# EasyEDA Pro project Sauce Dispenser.eprj

# Schematic Schematic1

## Sheets
1 P1: Board Name: Board1; Create Date: 2026-06-05; Page Name: P1; Project Name: Sauce Dispenser; Schematic Name: Schematic1; Update Date: 2026-06-06; Company: EasyEDA.com; Page Size: A4; Version: V1.0
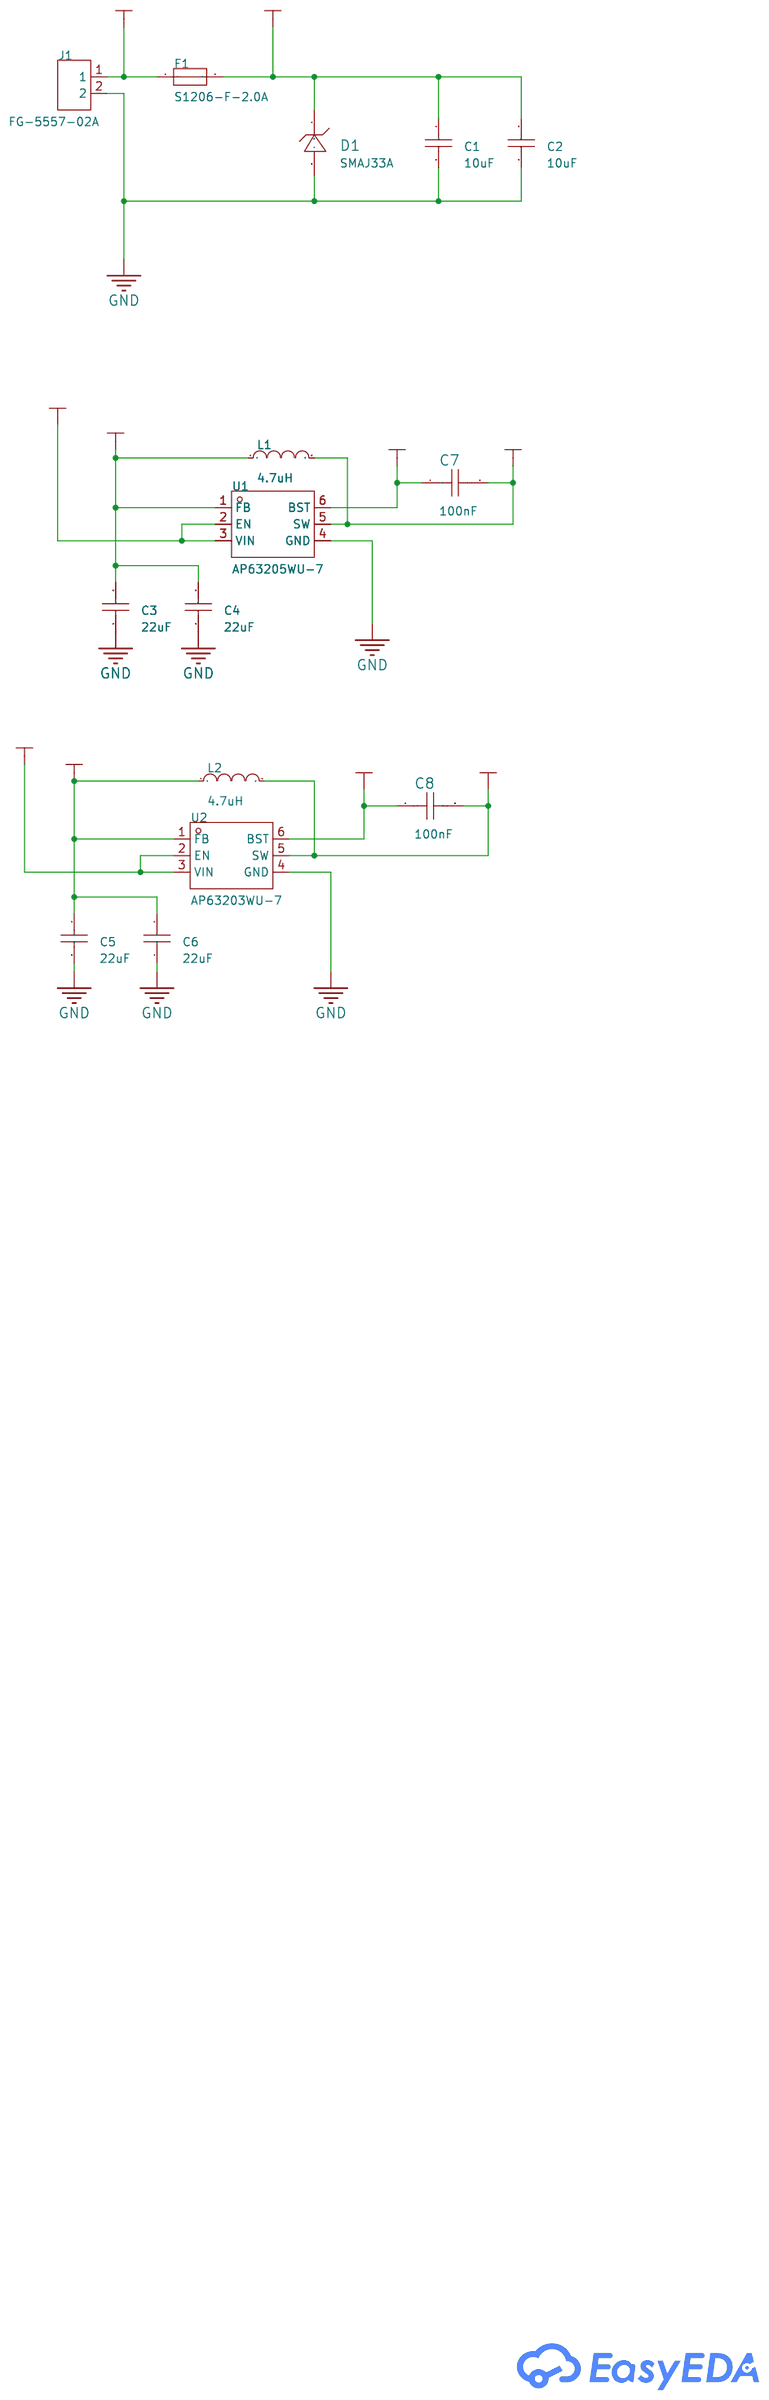
[diagram p0: P1]
2 P2: Create Date: 2026-06-06; Project Name: Project Name; Schematic Name: Schematic Name; Update Date: 2021.11.05
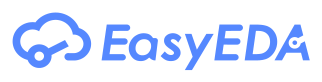
[diagram p1: P2]

## Parts
C1  10uF  [C1206]
C2  10uF  [C1206]
C3  22uF  [C1206]
C4  22uF  [C1206]
C5  22uF  [C1206]
C6  22uF  [C1206]
C7  100nF  [C0603]
C8  100nF  [C0603]
D1  SMAJ33A  [SMA_L4.3-W2.6-LS5.2-RD]
F1  S1206-F-2.0A  [F1206]
J1  FG-5557-02A  [CONN-TH_FG-5557-02A]
L1  4.7uH  [IND-SMD_L5.4-W5.2]
L2  4.7uH  [IND-SMD_L5.4-W5.2]
U1  AP63205WU-7  [TSOT-23-6_L2.9-W1.6-P0.95-LS2.8-BL]
U2  AP63203WU-7  [TSOT-26_L2.9-W1.6-P0.95-LS2.8-BL]

## Library data of the parts
C1 C2 = CL31A106KBHNNNE: LCSC Part Name: 10uF ±10% 50V; Supplier Part: C13585; Manufacturer: SAMSUNG(三星); Supplier Footprint: 1206; JLCPCB Part Class: Basic Part; Datasheet: https://item.szlcsc.com/datasheet/CL31A106KBHNNNE/14236.html; Supplier: LCSC; Tolerance: ±10%; Voltage Rating: 50V; Temperature Coefficient: X5R
C3-C6 = CL31A226KAHNNNE: LCSC Part Name: 22uF ±10% 25V; Supplier Part: C12891; Manufacturer: SAMSUNG(三星); Supplier Footprint: 1206; JLCPCB Part Class: Basic Part; Datasheet: https://item.szlcsc.com/datasheet/CL31A226KAHNNNE/13537.html; Supplier: LCSC; Tolerance: ±10%; Voltage Rating: 25V; Temperature Coefficient: X5R
C7 C8 = CL10B104KB8NNNC: LCSC Part Name: 100nF ±10% 50V; Supplier Part: C1591; Manufacturer: SAMSUNG(三星); Supplier Footprint: 0603; JLCPCB Part Class: Extended Part; Datasheet: https://item.szlcsc.com/datasheet/CL10B104KB8NNNC/1943.html; Supplier: LCSC; Tolerance: ±10%; Voltage Rating: 50V; Temperature Coefficient: X7R
D1 = SMAJ33A_C113966: LCSC Part Name: 单向TVS 33V截止 7.5A峰值脉冲; Supplier Part: C113966; Manufacturer: MDD; Supplier Footprint: SMA(DO-214AC); JLCPCB Part Class: Extended Part; Datasheet: https://atta.szlcsc.com/upload/public/pdf/source/20230314/4319D8044EE29783A53F6AC60595AA71.pdf; Supplier: LCSC; Reverse Stand-Off Voltage (Vrwm): 33V; Maximum Clamping Voltage: 53.3V; Peak Pulse Current (Ipp)@10/1000us: 7.5A; Breakdown Voltage: 36.7V; Type: TVS
F1 = S1206-F-2.0A: LCSC Part Name: 贴片式陶瓷保险丝; Supplier Part: C553922; Manufacturer: SART(萨特); Supplier Footprint: 1206; JLCPCB Part Class: Extended Part; Datasheet: https://item.szlcsc.com/datasheet/S1206-F-2.0A/574959.html; Supplier: LCSC; Type: Surface Mount Fuse; Current Rating: 2A; Voltage Rating (DC): 32V; Operating Temperature: -55℃~+125℃; Melting I2t: 0.1251; Interrupt Rating: 50A; Length: 3.2mm; Width: 1.6mm
J1 = FG-5557-02A: LCSC Part Name: 1x2P 间距:4.2mm 直插; Supplier Part: C53325659; Manufacturer: FG(富港); Supplier Footprint: 插件,P=4.2mm; JLCPCB Part Class: Extended Part; Datasheet: https://item.szlcsc.com/datasheet/FG-5557-02A/56414593.html; Supplier: LCSC; Pins Structure: 1x2P; Pitch: 4.2mm; Mounting Type: Through Hole; Number of Pins: 2P; Number of Rows: 1; Number of PINs Per Row: 2; Current Rating: 7A; Contact Material: Brass; Contact Plating: Tin; Operating Temperature: -25℃~+85℃; Plastic Material: PA66; Flame Retardant Rating: UL94V-2; Z-Height of the Board: 12.8mm; X-Length of Bottom Edge on Board (Spacing Line): 9.6mm; Y-Width of Bottom Edge on Board: 6.8mm
L1 L2 = MWSA0503S-4R7MT: LCSC Part Name: 4.7uH ±20% 4.6A; Supplier Part: C408410; Manufacturer: Sunlord(顺络); Supplier Footprint: SMD,5.4x5.2mm; JLCPCB Part Class: Extended Part; Datasheet: https://item.szlcsc.com/datasheet/MWSA0503S-4R7MT/397762.html; Supplier: LCSC; Tolerance: ±20%; Current Rating: 4.5A; Current - Saturation(Isat): 4.6A; DC Resistance(DCR): 60mΩ
U1 = AP63205WU-7: LCSC Part Name: 降压型 2A 3.8V~32V; Supplier Part: C2071056; Manufacturer: DIODES(美台); Supplier Footprint: TSOT-23-6; JLCPCB Part Class: Extended Part; Datasheet: https://item.szlcsc.com/datasheet/AP63205WU-7/2162639.html; Supplier: LCSC; Function: Step-down type; Voltage - Supply: 3.8V~32V; Output Voltage: 5V; Output Current: 2A; Frequency - Switching: 1.1MHz; Operating Temperature: -40℃~+85℃@(TA); Synchronous Rectifier: Yes; Number of Outputs: 1; Topology: Buck; Quiescent Current: 22uA; Switch tube (built-in/external): Built-in; Output Type: Fixed; Features: Light load efficient mode；Cycle-by-cycle current limiting；Overcurrent Protection；EMI optimization (spread spectrum)；Hiccup current limiting
U2 = AP63203WU-7: LCSC Part Name: 降压型 2A 3.8V~32V; Supplier Part: C780769; Manufacturer: DIODES(美台); Supplier Footprint: TSOT-23-6; JLCPCB Part Class: Extended Part; Datasheet: https://item.szlcsc.com/datasheet/AP63203WU-7/832852.html; Supplier: LCSC; Function: Step-down type; Voltage - Supply: 3.8V~32V; Output Voltage: 3.3V; Output Current: 2A; Frequency - Switching: 1.1MHz; Operating Temperature: -40℃~+85℃@(TA); Synchronous Rectifier: Yes; Number of Outputs: 1; Topology: Buck; Quiescent Current: 22uA; Switch tube (built-in/external): Built-in; Output Type: Fixed; Features: Light load efficient mode；Cycle-by-cycle current limiting；Overcurrent Protection；EMI optimization (spread spectrum)；Hiccup current limiting

## Nets
GND: C1.2 C2.1 C3.1 C4.1 C5.1 C6.1 D1.2(A) J1.2 U1.4(GND) U2.4(GND)
VDD_3V3: C5.2 C6.2 L2.1 U2.1(FB)
VIN_24V_IN: F1.1 J1.1
VIN_24V_PROTECTED: C1.1 C2.2 D1.1(C) F1.2 U1.2(EN) U1.3(VIN) U2.2(EN) U2.3(VIN)
BUCK3V3_BST: C8.1 U2.6(BST)
BUCK3V3_SW: C8.2 L2.2 U2.5(SW)
BUCK5_BST: C7.1 U1.6(BST)
BUCK5_SW: C7.2 L1.2 U1.5(SW)
VCTRL_5V: C3.2 C4.2 L1.1 U1.1(FB)
